# Altium project Systolic.PrjPcb
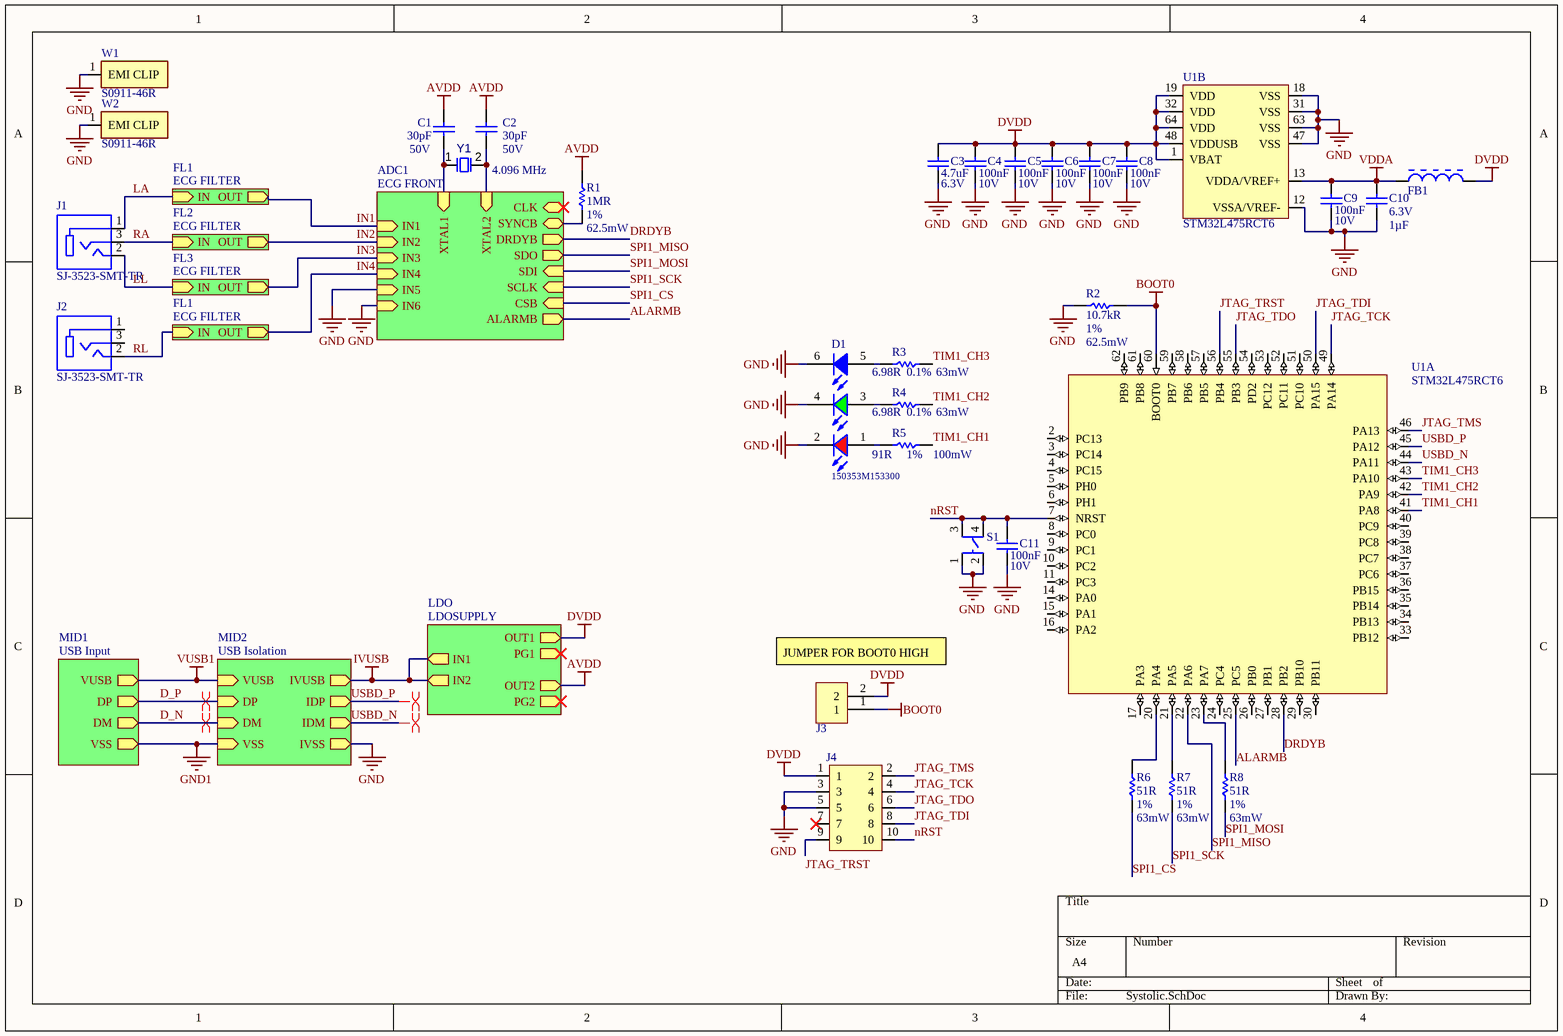
[diagram p0: Systolic.SchDoc]
6 sheets, 95 parts. Net scope: hierarchical (ports join the sheet entries above them; power ports are global).
Board file: Systolic.PcbDoc
Sheets:
  Systolic.SchDoc
    MID1 = USB Input.SchDoc
    MID2 = USB Isolation.SchDoc
    ADC1 = ECG FRONT.SchDoc
    LDO = LDOSUPPLY.SchDoc
    FL1 = ECG FILTER.SchDoc
    FL2 = ECG FILTER.SchDoc
    FL3 = ECG FILTER.SchDoc
    FL1 = ECG FILTER.SchDoc

## Sheet Systolic.SchDoc: Systolic
size A4

### Parts
C1  Capacitance: 30pF  Voltage Rating: 50V  [0402 CAPACITOR]  (hidden comment: MC0402N300J500CT)
C2  Capacitance: 30pF  Voltage Rating: 50V  [0402 CAPACITOR]  (hidden comment: MC0402N300J500CT)
C3  Capacitance: 4.7uF  Voltage Rating: 6.3V  [0402 CAPACITOR]  (hidden comment: CL10A475KQ8NNNC)
C4  Capacitance: 100nF  Voltage Rating: 10V  [0402 CAPACITOR]  (hidden comment: C0402C104K8PACTU)
C5  Capacitance: 100nF  Voltage Rating: 10V  [0402 CAPACITOR]  (hidden comment: C0402C104K8PACTU)
C6  Capacitance: 100nF  Voltage Rating: 10V  [0402 CAPACITOR]  (hidden comment: C0402C104K8PACTU)
C7  Capacitance: 100nF  Voltage Rating: 10V  [0402 CAPACITOR]  (hidden comment: C0402C104K8PACTU)
C8  Capacitance: 100nF  Voltage Rating: 10V  [0402 CAPACITOR]  (hidden comment: C0402C104K8PACTU)
C9  Capacitance: 100nF  Voltage Rating: 10V  [0402 CAPACITOR]  (hidden comment: C0402C104K8PACTU)
C10  value 1µF  Voltage Rating (DC): 6.3V  [0402 CAPACITOR]  (hidden comment: C0402C105K9PACTU)
C11  Capacitance: 100nF  Voltage Rating: 10V  [0402 CAPACITOR]  (hidden comment: C0402C104K8PACTU)
D1  150353M153300  [WL-SFTD_3535]
FB1  BLM15AX601SN1D  [0402 RESISTOR]  (value not drawn)
J1  SJ-3523-SMT-TR  [CUI_SJ-3523-SMT-TR]
J2  SJ-3523-SMT-TR  [CUI_SJ-3523-SMT-TR]
J3  SAMTEC-TSW-102-07-X-SJ  [SAMTEC-TSW-102-07-X-S]  (value not drawn)
J4  FTSH-105-01-L-DV-K-P  [FTSH-105-01-L-DV-K-P]  (value not drawn)
R1  Resistance: 1MR  Tolerance: 1%  Power Rating: 62.5mW  [0402 RESISTOR]  (hidden comment: MCWR04X1004FTL)
R2  Resistance: 10.7kR  Tolerance: 1%  Power Rating: 62.5mW  [0402 RESISTOR]  (hidden comment: MCWR04X1072FTL)
R3  Resistance: 6.98R  Tolerance: 0.1%  Power Rating: 63mW  [0603 RESISTOR]  (hidden comment: RN73C1J6R98BTDF)
R4  Resistance: 6.98R  Tolerance: 0.1%  Power Rating: 63mW  [0603 RESISTOR]  (hidden comment: RN73C1J6R98BTDF)
R5  Resistance: 91R  Tolerance: 1%  Power Rating: 100mW  [0603 RESISTOR]  (hidden comment: CRCW060391R0FKEA)
R6  Resistance: 51R  Tolerance: 1%  Power Rating: 63mW  [0402 RESISTOR]  (hidden comment: CRCW040251R0FKED)
R7  Resistance: 51R  Tolerance: 1%  Power Rating: 63mW  [0402 RESISTOR]  (hidden comment: CRCW040251R0FKED)
R8  Resistance: 51R  Tolerance: 1%  Power Rating: 63mW  [0402 RESISTOR]  (hidden comment: CRCW040251R0FKED)
S1  TL3305BF260QG  [TL3305BF260QG-Footprint-1]  (value not drawn)
U1  STM32L475RCT6  [TSQFP50P1200X1200X160-64N]  (parts A,B of 2)
W1  S0911-46R  [S0911-46R-Footprint-1]
W2  S0911-46R  [S0911-46R-Footprint-1]
Y1  Frequency: 4.096 MHz  [Crystal]  (hidden comment: ABLS-4.096MHZ-20-B-4-Y-T)

### Sub-sheets
ADC1 = ECG FRONT: IN1 (in), IN2 (in), IN3 (in), DRDYB (out), SDO (out), SDI (in), SCLK (in), CSB (in), ALARMB (out), CLK (bidir), XTAL1 (in), XTAL2 (in), SYNCB (bidir), IN6 (in), IN4 (in), IN5 (in)
FL1 = ECG FILTER: OUT (out), IN (in)
FL1 = ECG FILTER: OUT (out), IN (in)
FL2 = ECG FILTER: OUT (out), IN (in)
FL3 = ECG FILTER: OUT (out), IN (in)
LDO = LDOSUPPLY: IN1 (out), PG1 (out), PG2 (out), IN2 (out), OUT1 (out), OUT2 (out)
MID1 = USB Input: VUSB (out), DP (out), DM (out), VSS (out)
MID2 = USB Isolation: VUSB (in), DP (in), DM (in), VSS (in), IVUSB (out), IDP (out), IDM (out), IVSS (out)

### Nets
AVDD: C1.2 C2.2 R1.1 ; sheet LDO/OUT2
BOOT0: J3.1 R2.2 U1.60(BOOT0)
DVDD: C3.2 C4.2 C5.2 C6.2 C7.2 C8.2 FB1.2 J3.2 J4.1 U1.1(VBAT) U1.19(VDD) U1.32(VDD) U1.48(VDDUSB) U1.64(VDD) ; sheet LDO/OUT1
GND: C3.1 C4.1 C5.1 C6.1 C7.1 C8.1 C9.1 C10.1 C11.1 D1.2(K) D1.4(K) D1.6(K) J4.3 J4.5 R2.1 S1.1 S1.2 U1.12(VSSA/VREF-) U1.18(VSS) U1.31(VSS) U1.47(VSS) U1.63(VSS) W1.1(EMI_CLIP) W2.1(EMI_CLIP) ; sheet MID2/IVSS, sheet ADC1/IN6, sheet ADC1/IN5
GND1: sheet MID1/VSS, sheet MID2/VSS
IVUSB: sheet MID2/IVUSB, sheet LDO/IN1, sheet LDO/IN2
VDDA: C9.2 C10.2 FB1.1 U1.13(VDDA/VREF+)
VUSB1: sheet MID1/VUSB, sheet MID2/VUSB
ALARMB: U1.25(PC5) ; sheet ADC1/ALARMB
D_N: sheet MID1/DM, sheet MID2/DM
D_P: sheet MID1/DP, sheet MID2/DP
DRDYB: U1.28(PB2) ; sheet ADC1/DRDYB
IN1: sheet ADC1/IN1, sheet FL1/OUT
IN2: sheet ADC1/IN2, sheet FL2/OUT
IN3: sheet ADC1/IN3, sheet FL3/OUT
IN4: sheet ADC1/IN4, sheet FL1/OUT
JTAG_TCK: J4.4 U1.49(PA14)
JTAG_TDI: J4.8 U1.50(PA15)
JTAG_TDO: J4.6 U1.55(PB3)
JTAG_TMS: J4.2 U1.46(PA13)
JTAG_TRST: J4.9 U1.56(PB4)
LA: J1.1 ; sheet FL1/IN
LL: J1.2 ; sheet FL3/IN
nRST: C11.2 J4.10 S1.3 S1.4 U1.7(NRST)
RA: J1.3 ; sheet FL2/IN
RL: J2.2 ; sheet FL1/IN
SPI1_CS: R6.1 ; sheet ADC1/CSB
SPI1_MISO: U1.22(PA6) ; sheet ADC1/SDO
SPI1_MOSI: R8.1 ; sheet ADC1/SDI
SPI1_SCK: R7.1 ; sheet ADC1/SCLK
TIM1_CH1: R5.2 U1.41(PA8)
TIM1_CH2: R4.2 U1.42(PA9)
TIM1_CH3: R3.2 U1.43(PA10)
USBD_N: U1.44(PA11) ; sheet MID2/IDM
USBD_P: U1.45(PA12) ; sheet MID2/IDP
XTAL_N: C1.1 Y1.1 ; sheet ADC1/XTAL1
XTAL_P: C2.1 Y1.2 ; sheet ADC1/XTAL2
NetD1_1: D1.1(A) R5.1
NetD1_3: D1.3(A) R4.1
NetD1_5: D1.5(A) R3.1
NetR1_2: R1.2 ; sheet ADC1/SYNCB
NetR6_2: R6.2 U1.20(PA4)
NetR7_2: R7.2 U1.21(PA5)
NetR8_2: R8.2 U1.23(PA7)

Not connected (* = marked no-connect by the designer): J2 1 3; J4 7*; U1 2(PC13) 3(PC14) 4(PC15) 5(PH0) 6(PH1) 8(PC0) 9(PC1) 10(PC2) 11(PC3) 14(PA0) 15(PA1) 16(PA2) 17(PA3) 24(PC4) 26(PB0) 27(PB1) 29(PB10) 30(PB11) 33(PB12) 34(PB13) 35(PB14) 36(PB15) 37(PC6) 38(PC7) 39(PC8) 40(PC9) 51(PC10) 52(PC11) 53(PC12) 54(PD2) 57(PB5) 58(PB6) 59(PB7) 61(PB8) 62(PB9)

### Layout directives
differential pair; differential pair class USB: D_N, D_P, USBD_N, USBD_P

### Notes on the sheet
- (near J3) JUMPER FOR BOOT0 HIGH

### Library data of the parts
C1 C2 = CMP-001-00092-2: Cap Ceramic 30pF 50V C0G 5% SMD 0402 125°C; Temperature Coefficient: 30ppm/°C; Packaging: Cut Tape; Case/Package: 0402; Min Operating Temperature: -55°C; Number of Pins: 2; Voltage Rating (DC): 50V; Case Code (Imperial): 0402; Max Operating Temperature: 125°C; REACH SVHC: No SVHC; Case Code (Metric): 1005; Width: 0.5mm; Dielectric: C0G; Tolerance: 5%
C3 = CMP-001-00091-2: Cap Ceramic 4.7uF 6.3V X5R 10% SMD 0402 85°C; Max Operating Temperature: 85°C; Radiation Hardening: No; Voltage: 6.3V; Case Code (Metric): 1608; Case/Package: 0603; Tolerance: 10%; Dielectric: X5R; Mount: Surface Mount; Packaging: Tape and Reel; Height: 0.8mm; Thickness: 0.035inch; Length: 1.6mm; Contact Plating: Tin; Package Quantity: 1; Depth: 0.8mm; Min Operating Temperature: -55°C; Width: 0.031inch; Material: Ceramic; Case Code (Imperial): 0603
C4-C9 C11 = CMP-001-00061-5: Cap Ceramic 0.1uF 10V X5R 10% SMD 0402 85°C; Dissipation Factor: 5%; Number of Pins: 2; Case Code (Metric): 1005; Min Operating Temperature: -55°C; Thickness: 0.022inch; Radiation Hardening: No; Packaging: Tape and Reel; Depth: 0.5mm; Voltage: 10V; Lead Pitch: 0.3mm; Voltage Rating (DC): 10V; Mount: Surface Mount,PCB; Max Operating Temperature: 85°C; Termination: SMD/SMT; Case Code (Imperial): 0402; Width: 0.02inch; REACH SVHC: No SVHC; Contact Plating: Tin,Matte; Length: 1mm; Package Quantity: 1; Dielectric: X5R; Tolerance: 10%; Lead Free: Lead Free; Dielectric Material: Ceramic; Case/Package: 0402; Height: 0.5mm
C10 = CMP-009-0032-3: CAP CER 1UF 6.3V 10% X5R 0402; Manufacturer: KEMET; Dielectric Material: Ceramic; ComponentLink2URL: https://datasheet.ciiva.com/11786/0900766b8116eb59-11786028.pdf?src-supplier=RSComponents; Mount: Surface Mount; REACH SVHC: No SVHC; Height: 0.5mm; Max Operating Temperature: 85°C; ComponentLink5Description: https://datasheet.ciiva.com/18192/getdatasheetpartid-127800-18192427.pdf?src-supplier=Verical; Category: Ceramic Capacitors; Package Quantity: 1; Manufacturer Part Number: C0402C105K9PACTU; ComponentLink5URL: https://datasheet.ciiva.com/18192/getdatasheetpartid-127800-18192427.pdf?src-supplier=Verical; Case/Package: 0402; Tolerance: 10%; Packaging: Tape and Reel; ComponentLink4Description: https://datasheet.ciiva.com/7747/40889-7747623.pdf?src-supplier=Element14; Width: 0.02inch; RoHS: Yes; Depth: 0.5mm; ComponentLink1URL: https://datasheet.ciiva.com/28645/1789732-28645392.pdf?src-supplier=Element14; Length: 1mm; Source: MyLib.SchLib; Stock 1: 76830; Lead Pitch: 0.3mm; Pins: 2; Thickness: 0.022inch; Termination: SMD/SMT; ComponentLink3URL: https://datasheet.ciiva.com/7747/kem-c1006-x5r-smd-7747445.pdf?src-supplier=Element14; Pricing 1: 10=0.02950, 100=0.01910, 500=0.01410, 2500=0.01080, 5000=0.00930 (GBP); ComponentLink1Description: https://datasheet.ciiva.com/28645/1789732-28645392.pdf?src-supplier=Element14; ComponentLink2Description: https://datasheet.ciiva.com/11786/0900766b8116eb59-11786028.pdf?src-supplier=RSComponents; Design Item ID: C0402C105K9PACTU; Radiation Hardening: No; Voltage Rating: 6.3V; ComponentLink4URL: https://datasheet.ciiva.com/7747/40889-7747623.pdf?src-supplier=Element14; Min Operating Temperature: -55°C; Dielectric: X5R; Voltage: 6.3V; ComponentLink3Description: https://datasheet.ciiva.com/7747/kem-c1006-x5r-smd-7747445.pdf?src-supplier=Element14; Lead Free: Lead Free
D1 = CMP-080-0003-1: WL-SFTD SMT Full-color Top LED Diffused, size 3535, Red & Green & Blue, 120deg; Dominant Wavelength typ.: Blue:470nm, Green:520nm, Red:625nm; Peak Wavelength typ.: Blue:465nm, Green:515nm, Red:635nm; Luminous Intensity typ.: Blue:400mcd, Green:1900mcd, Red:800mcd; Chip Technology: AlInGaP + GaN; Forward Voltage typ.: Blue:3.2V, Green:3.2V, Red:2V; Published Date: December 2019; Viewing Angle: 120deg; ComponentLink2Description: Datasheet; ComponentLink2URL: https://www.we-online.com/catalog/datasheet/150353M153300.pdf; ComponentLink1Description: Manufacturer; Part Number: 150353M153300; Publisher: Wurth Elektronik; ComponentLink1URL: http://www.we-online.de; Operating Temperature: -40 to +85degC; Packaging: Tape and Reel; Source: WL-SFTD.SchLib; Mounting Technology: SMT; Emitting Color: Red & Green & Blue; Design Item ID: 150353M153300; Size: 3535
FB1 = CMP-006-00023-1: Ferrite Beads Multi-Layer 600Ohm 25% 100MHz 500mA 340mOhm DCR 0402 T/R; Number of Lines: 1; DC Resistance (DCR): 340mR; Material: Steel,Ferrite; Impedance: 600R; Core Material: Ferrite; Width: 0.5mm; Lead Free: Lead Free; Case/Package: 0402; Max Current Rating: 500mA; Number of Pins: 2; Case Code (Metric): 1005; Case Code (Imperial): 0402; Min Operating Temperature: -55°C; REACH SVHC: No SVHC; Length: 1mm; Termination: SMD/SMT; Package Quantity: 1; Tolerance: 25%; Current Rating: 500mA; Depth: 0.5mm; Height: 0.5mm; Max Operating Temperature: 125°C; Number of Circuits: 1; Test Frequency: 100MHz; Packaging: Tape and Reel; Max DC Current: 500mA
J1 J2 = CMP-023-0000-1: CONN JACK STEREO 3.5MM SMD R/A; Manufacturer 1: CUI; MF: CUI Devices; Number of Conductors: 3; Shielding: Unshielded; Current Rating: 1A; Number of Ports: 1; Gender: Female; ComponentLink2Description: https://datasheet.ciiva.com/7356/sj-352x-smt-series-7356569.pdf?src-supplier=Digi-Key; Availability: Unavailable; Case/Package: LGA-10 STMicroelectronics; ComponentLink2URL: https://datasheet.ciiva.com/7356/sj-352x-smt-series-7356569.pdf?src-supplier=Digi-Key; Price: None; Color: Black; ComponentLink1URL: https://datasheet.ciiva.com/7356/sj-352x-smt-series-7356553.pdf?src-supplier=Digi-Key; Pricing 1: 1000=0.51360, 2000=0.48150, 3000=0.46545, 5000=0.44940, 10000=0.42693, 25000=0.41730 (USD); Stock 1: 40782; Connector Type: Jack; Termination: Solder; Design Item ID: SJ-3523-SMT-TR; Lead Free: Lead Free; Contact Plating: Silver; Value: *; MP: SJ-3523-SMT-TR; ComponentLink1Description: https://datasheet.ciiva.com/7356/sj-352x-smt-series-7356553.pdf?src-supplier=Digi-Key; SnapEDA_Link: https://www.snapeda.com/parts/SJ-3523-SMT-TR/CUI%20Devices/view-part/251570/?ref=snap; Category: Connectors; Mount: Surface Mount; Packaging: Cut Tape; CUI_purchase_URL: https://www.cuidevices.com/product/interconnect/connectors/audio-connectors/jacks/sj-352x-smt-series?utm_source=snapeda.com&utm_medium=referral&utm_campaign=snapedaBOM; RoHS: Yes; Manufacturer Part Number 1: SJ-3523-SMT-TR; Source: SnapEDAsch.SchLib; Orientation: Horizontal
J3 = CMP-087-0000-1: Component Type: Standard; Design Item ID: SAMTEC-TSW-102-07-X-SJ; Source: SAMTEC-TSW-102-07-X-S.SCHLIB; Pin Count: 2
J4 = CMP-066-0000-6: TERMINAL STRIP, .050"(1.27mm) PITCH, 10 PINS, KEYED; MANUFACTURER: SAMTEC; PCB DECAL: FTSH-105-01-XXX-DV-K; Design Item ID: FTSH-105-01-L-DV-K-P; Source: FTSH-105-01-L-DV-K-P.SCHLIB; CREATED: November 30, 2016 - Wendy Xin
R1 = CMP-009-00177-1: 1MR 0402; Voltage Rating (DC): 50V; Temperature Coefficient: 100ppm/°C; Case Code (Metric): 1005; Case/Package: 0402; Voltage Rating: 50V; Mount: Surface Mount; Packaging: Cut Tape; REACH SVHC: No SVHC; Composition: Thick Film; Case Code (Imperial): 0402
R2 = CMP-009-00185-1: MULTICOMP - MCMR04X24R0FTL - RES, CERAMIC 10.7kR, 1%, 0.063W, 0402; Voltage Rating (DC): 50V; Temperature Coefficient: 100ppm/°C; Case Code (Metric): 1005; Composition: Ceramic; REACH SVHC: No SVHC; Case Code (Imperial): 0402; Packaging: Cut Tape; Voltage Rating: 50V; Case/Package: 0402
R3 R4 = CMP-009-00193-1: RES, THIN FILM 6.98R, 0.1%, 0.063W, 0603; Voltage Rating (DC): 50V; Temperature Coefficient: 10ppm/°C; Number of Resistors: 1; Max Operating Temperature: 155°C; Case Code (Metric): 1608; Length: 1.55mm; Weight: 7.1E-05oz; Composition: Thin Film; Height: 0.45mm; Case Code (Imperial): 0603; Case/Package: 0603; Mount: Surface Mount; Min Operating Temperature: -55°C; Voltage Rating: 50V; Termination: Solder; Width: 0.8mm; Package Quantity: 1000; Packaging: Tape and Reel; ELV: Compliant; Number of Terminations: 2
R5 = CMP-009-00192-1: RES, THICK FILM 91R, 1%, 0.1W, 0603; Voltage Rating: 75V; Temperature Coefficient: 100ppm/°C; Height: 0.45mm; Packaging: Tape and Reel; Package Quantity: 10; Military Standard: Not; Composition: Thick Film; Contact Plating: Tin; Case Code (Imperial): 0603; Radiation Hardening: No; Weight: 7.1E-05oz; Case Code (Metric): 1608; Case/Package: 0603; REACH SVHC: Unknown; Termination: SMD/SMT; Lead Free: Lead Free; Depth: 0.85mm; Length: 1.55mm; Max Operating Temperature: 155°C; Min Operating Temperature: -55°C; Voltage Rating (DC): 75V; Number of Pins: 2; Number of Terminations: 2; Features: Automotive AEC-Q200; Width: 0.033inch; Max Power Dissipation: 100mW
R6-R8 = CMP-009-00186-1: 51R 0402 AEC-Q200; Voltage Rating (DC): 50V; Temperature Coefficient: 100ppm/°C; Lead Free: Lead Free; REACH SVHC: Unknown; Package Quantity: 10; Case Code (Imperial): 0402; Case Code (Metric): 1005; Military Standard: Not; Length: 1mm; Width: 0.5mm; Number of Terminations: 2; Voltage Rating: 50V; Weight: 2.3E-05oz; Case/Package: 0402; Max Operating Temperature: 155°C; Max Power Dissipation: 63mW; Termination: SMD/SMT; Depth: 0.5mm; Packaging: Tape and Reel; Features: Automotive AEC-Q200; Min Operating Temperature: -55°C; Composition: Thick Film; Radiation Hardening: No; Number of Pins: 2; Height: 0.35mm; Contact Plating: Tin
S1 = CMP-011-00013-1: Switch Tactile N.O. SPST Round Button Gull Wing 0.05A 12VDC 2.55N SMD T/R; Illumination Type: Non-Illuminated; Mechanical Life: 200000Cycles; Actuator Type: Standard; Operating Force: 260gf; Switch Travel: 0.2mm; Switch Function: Off-Mom; Lead Free: Lead Free; Throw Configuration: SPST; Termination: Gull Wing; Max Operating Temperature: 70°C; Mount: Surface Mount; Min Operating Temperature: -20°C; Packaging: Tape and Reel
U1 = CMP-020-00023-2: Ultra-low-power with FPU ARM Cortex-M4 MCU 80 MHz with 256 Kbytes Flash, USB OTG; Oscillator Type: Internal; Frequency: 80MHz; Peripherals: Brown-out Detect/Reset,PWM,WDT,DMA; Interface: I2C,SPI,USB,IrDA,MMC,SD,UART,USART; Memory Size: 256KB; Number of I/Os: 51; Core Architecture: ARM; Max Operating Temperature: 85°C; Min Operating Temperature: -40°C; Memory Type: FLASH; Case/Package: LQFP; Packaging: Tray
W1 W2 = CMP-00028-00008-1: Compact RFI Shield Clip Socket Surface Mount Beryllium Copper T/R
Y1 = CMP-003-00032-1: Load Capacitance: 20 pF; Frequency Tolerance: 30ppm

## Sheet USB Input.SchDoc
size A
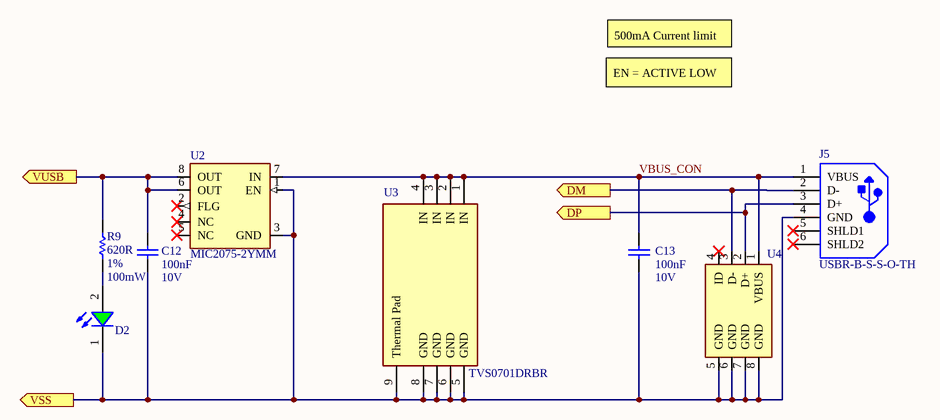
[diagram p1: USB Input.SchDoc]

### Parts
C12  Capacitance: 100nF  Voltage Rating: 10V  [0402 CAPACITOR]  (hidden comment: C0402C104K8PACTU)
C13  Capacitance: 100nF  Voltage Rating: 10V  [0402 CAPACITOR]  (hidden comment: C0402C104K8PACTU)
D2  150060VS73220  [WL-SMCC_0603_RS_VS_YS]  (value not drawn)
J5  USBR-B-S-S-O-TH  [SMTC-USBR-TH-4_V]
R9  Resistance: 620R  Tolerance: 1%  Power Rating: 100mW  [0603 RESISTOR]  (hidden comment: MCMR06X6200FTL)
U2  MIC2075-2YMM  [TSOP65P490X102-8N]
U3  TVS0701DRBR  [FP-DRB0008A-MFG]
U4  Rclamp1255P.TGT  [SON40P200X65-8N]  (value not drawn)

### Ports
DM (out), DP (out), VSS (out), VUSB (out)

### Nets
GND1: C12.1 C13.1 D2.1(K) J5.4(GND) U2.1(EN) U2.3(GND) U3.5(GND) U3.6(GND) U3.7(GND) U3.8(GND) U3.9(Thermal_Pad) U4.5(GND) U4.6(GND) U4.7(GND) U4.8(GND) ; port VSS
VUSB1: C12.2 R9.2 U2.6(OUT) U2.8(OUT) ; port VUSB
D_N: J5.2(D-) U4.3(D-) ; port DM
D_P: J5.3(D+) U4.2(D+) ; port DP
VBUS_CON: C13.2 J5.1(VBUS) U2.7(IN) U3.1(IN) U3.2(IN) U3.3(IN) U3.4(IN) U4.1(VBUS)
NetD2_2: D2.2(A) R9.1

Not connected (* = marked no-connect by the designer): J5 5(SHLD1)* 6(SHLD2)*; U2 2(FLG)* 4(NC)* 5(NC)*; U4 4(ID)*

### Notes on the sheet
- 500mA Current limit
- EN = ACTIVE LOW

### Library data of the parts
C12 C13 = CMP-001-00061-5: as C4 on sheet Systolic; Number of Pins: 2; Case Code (Metric): 1005; Min Operating Temperature: -55°C; Thickness: 0.022inch; Radiation Hardening: No; Packaging: Tape and Reel; Depth: 0.5mm; Voltage: 10V; Lead Pitch: 0.3mm; Voltage Rating (DC): 10V; Mount: Surface Mount,PCB; Max Operating Temperature: 85°C; Termination: SMD/SMT; Case Code (Imperial): 0402; Width: 0.02inch; REACH SVHC: No SVHC; Contact Plating: Tin,Matte; Length: 1mm; Package Quantity: 1; Dielectric: X5R; Tolerance: 10%; Lead Free: Lead Free; Dielectric Material: Ceramic; Case/Package: 0402; Height: 0.5mm
D2 = 150060VS73220: WL-SMCC SMD Mono-color Chip LED Compact, size 0603, Bright Green, 2V, 120deg; Dominant Wavelength: 573nm; Luminous Intensity: 60mcd; Peak Wavelength: 575nm; Chip Technology: AlInGaP; ComponentLink1URL: http://www.we-online.de; ComponentLink2Description: Datasheet; ComponentLink2URL: https://katalog.we-online.com/led/datasheet/150060VS73220.pdf; Part Number: 150060VS73220; Published Date: July 2019; Publisher: Wurth Elektronik; Size: 0603; Viewing Angle: 120deg; Packaging: Tape and Reel; Emitting Color: Bright Green; Mounting Technology: SMT; Forward Voltage: 2V; Operating Temperature: -40 to +85degC
J5 = CMP-020-0000-1: Conn USB F 4 POS 2.5mm Solder RA Thru-Hole 4 Terminal 1 Port Tray; Manufacturer: SamtecInc.; Manufacturer 1: Samtec; Body Orientation: RightAngle; Rad Hard: No; Max Voltage Rating (AC): 30V; USB Standard: USB 2.0; Number of Contacts: 4; Number of Ports: 1; ComponentLink1Description: https://datasheet.ciiva.com/6743/1759611-6743744.pdf?src-supplier=Newark; Mounting Technology: ThroughHole; Datasheet URL: http://suddendocs.samtec.com/prints/usbr-b-s-x-o-th-x-mkt.pdf; Orientation: Right Angle; Length: 14.9mm; Max Operating Temperature: 85°C; Manufacturer Part Number 1: USBR-B-S-S-O-TH; ComponentLink5URL: https://datasheet.ciiva.com/3094/usb-b-3094454.pdf?src-supplier=Avnet; Package Quantity: 1; Case/Package: 4-Pin Through Hole Device, Body 16.3 x 12.04 mm, Pitch 2.5 mm; ComponentLink3URL: https://datasheet.ciiva.com/851/usbr-b-s-x-o-th-x-mkt-851782.pdf?src-supplier=Digi-Key; Manufacturer URL: http://www.samtec.com/; Min Operating Temperature: -50°C; REACH SVHC: No SVHC; Connector Type: USB; ComponentLink4Description: https://datasheet.ciiva.com/26826/getdatasheetpartid-475715-26826565.pdf?src-supplier=Verical; Depth: 16.5mm; Contact Plating: Gold; ComponentLink2URL: https://datasheet.ciiva.com/7622/452555-7622677.pdf?src-supplier=Element14; ComponentLink5Description: https://datasheet.ciiva.com/3094/usb-b-3094454.pdf?src-supplier=Avnet; Packaging: Trays; Package Reference: USBR-TH; Gender: F; Design Item ID: CMP-2000-07371-1; Number of Terminals: 4; Category: ConnectorAudioandVideo; ComponentLink1URL: https://datasheet.ciiva.com/6743/1759611-6743744.pdf?src-supplier=Newark; Pricing 1: 1=1.75000, 10=1.58800, 25=1.49040, 50=1.42560, 100=1.36080, 250=1.23120, 500=1.13400, 1000=0.97200, 2500=0.90720 (USD); Termination Method: Solder; Housing Material: Thermoplastic; Mounting: ThroughHole; Datasheet Version: Rev. J, 10/2010; ComponentLink3Description: https://datasheet.ciiva.com/851/usbr-b-s-x-o-th-x-mkt-851782.pdf?src-supplier=Digi-Key; Radiation Hardening: No; ComponentLink4URL: https://datasheet.ciiva.com/26826/getdatasheetpartid-475715-26826565.pdf?src-supplier=Verical; Pitch: 2.5mm; Source: Components - 12.06.20 - 19.51.SchLib; Mount: Through Hole,Horizontal; RoHS: Yes; Termination: Solder; Contact Material: Bronze; ComponentLink2Description: https://datasheet.ciiva.com/7622/452555-7622677.pdf?src-supplier=Element14; Type: USB; Stock 1: 4434
R9 = CMP-009-00202-2: RES, CERAMIC, 620R, 1%, 0.1W, 0603; Temperature Coefficient: 100ppm/°C; Voltage Rating: 75V; Case/Package: 0603; Case Code (Metric): 1608; Packaging: Cut Tape; REACH SVHC: No SVHC; Case Code (Imperial): 0603; Composition: Ceramic; Voltage Rating (DC): 75V
U2 = CMP-00028-00007-2: MIC2075 Series 5.5 V 140 mOhm Single-Channel Power Distribution Switch - SOIC-8; Max Output Current: 500mA; Output Configuration: High Side; Interface: On/Off; Number of Outputs: 1; Fault Protection: Over Temperature; Min Operating Temperature: -40°C; Max Operating Temperature: 85°C; Packaging: Rail/Tube; Lead Free: Lead Free
U3 = CMP-04985-000001-1: TVS ARRAYS; Manufacturer: Texas instruments; Capacitance: 77pF; Peak Pulse Current: 30A; Standoff Height: 0mm; Direction: Bidirectional; Number Of Channels: 1; Breakdown Voltage: 9.3V; Reverse Standoff Voltage: 7V; Value: 77pF; Clamping Voltage: 11V; Temperature Range Low: -40°C; Category: IC; Lead Free: Yes; Device Class L2: ESD and Circuit Protection ICs; Ambient Temperature Range High: +125°C; RoHS: TRUE; Manufacturer Part Number: TVS0701DRBR; Device Class L3: unset; Ambient Temperature Range Low: -40°C; Mouser Description: 7-V bidirectional flat-clamp surge protection device 8-SON -40 to 125; Height: 1mm; Octopart: https://octopart.com/tvs0701drbr-texas+instruments-96189204; Automotive: No; Temperature: -40°C to +125°C; ComponentLink2URL: http://www.ti.com/lit/ds/symlink/tvs0701.pdf; Device Class L1: Circuit Protection; Package: DRB0008A; Digikey Description: TVS ARRAYS; Temperature Range High: +125°C; ComponentLink2Description: Datasheet
U4 = CMP-00030-00003-1: Tvs Diode 4V 12.5V SLP2018P6; Peak Pulse Power: 40W; Power Line Protection: Yes; Min Breakdown Voltage: 4.5V; Peak Pulse Current: 3A; Number of Bidirectional Channels: 3; Reverse Standoff Voltage: 4V; Min Operating Temperature: -55°C; Clamping Voltage: 12.5V; Packaging: Tape and Reel; Mount: Surface Mount; Lead Free: Lead Free; Max Operating Temperature: 125°C

## Sheet USB Isolation.SchDoc
size A
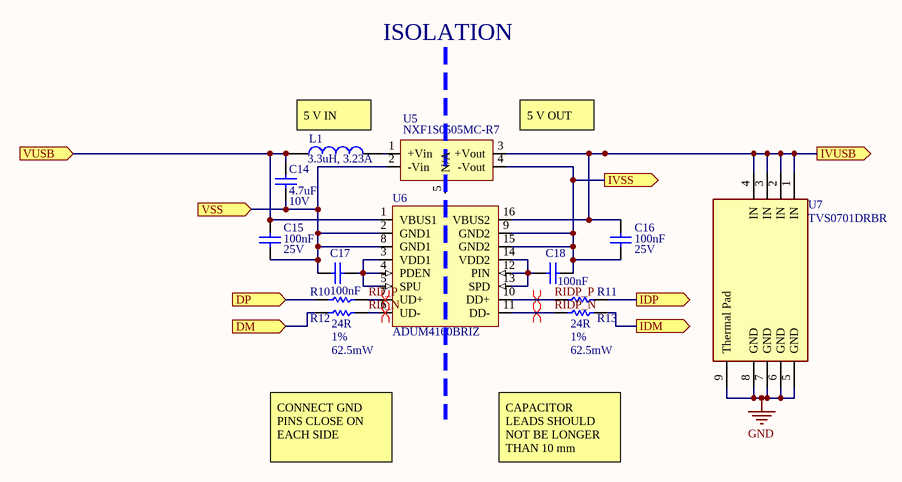
[diagram p2: USB Isolation.SchDoc]

### Parts
C14  value 4.7uF  Voltage Rating: 10V  [0603 CAPACITOR]  (hidden comment: LMK107BJ475KA-T)
C15  value 100nF  Voltage Rating: 25V  [0603 CAPACITOR]  (hidden comment: CGA3E2X7R1E104K080AA)
C16  value 100nF  Voltage Rating: 25V  [0603 CAPACITOR]  (hidden comment: CGA3E2X7R1E104K080AA)
C17  value 100nF  [0603 CAPACITOR]  (hidden comment: CGA3E2X7R1E104K080AA)
C18  value 100nF  [0603 CAPACITOR]  (hidden comment: CGA3E2X7R1E104K080AA)
L1  3.3uH, 3.23A  [WE-LQS_4025]
R10  MCMR04X24R0FTL  [0402 RESISTOR]  (value not drawn)
R11  MCMR04X24R0FTL  [0402 RESISTOR]  (value not drawn)
R12  Resistance: 24R  Tolerance: 1%  Power Rating: 62.5mW  [0402 RESISTOR]  (hidden comment: MCMR04X24R0FTL)
R13  Resistance: 24R  Tolerance: 1%  Power Rating: 62.5mW  [0402 RESISTOR]  (hidden comment: MCMR04X24R0FTL)
U5  NXF1S0505MC-R7  [QFN254P1524X1067X501-6N]
U6  ADUM4160BRIZ  [SOIC127P1030X265-16N]
U7  TVS0701DRBR  [FP-DRB0008A-MFG]

### Ports
DM (in), DP (in), IDM (out), IDP (out), IVSS (out), IVUSB (out), VSS (in), VUSB (in)

### Nets
GND: C16.1 C18.1 U5.4(-Vout) U6.9(GND2) U6.15(GND2) U7.5(GND) U7.6(GND) U7.7(GND) U7.8(GND) U7.9(Thermal_Pad) ; port IVSS
GND1: C14.1 C15.1 C17.2 U5.2(-Vin) U6.2(GND1) U6.8(GND1) ; port VSS
IVUSB: C16.2 U5.3(+Vout) U6.16(VBUS2) U7.1(IN) U7.2(IN) U7.3(IN) U7.4(IN) ; port IVUSB
VUSB1: C14.2 C15.2 L1.1 U6.1(VBUS1) ; port VUSB
D_N: R12.1 ; port DM
D_P: R10.1 ; port DP
RD_N: R12.2 U6.6(UD-)
RD_P: R10.2 U6.7(UD+)
RIDP_N: R13.1 U6.11(DD-)
RIDP_P: R11.1 U6.10(DD+)
USBD_N: R13.2 ; port IDM
USBD_P: R11.2 ; port IDP
NetC17_1: C17.1 U6.3(VDD1) U6.4(PDEN) U6.5(SPU)
NetC18_2: C18.2 U6.12(PIN) U6.13(SPD) U6.14(VDD2)
NetL1_2: L1.2 U5.1(+Vin)

Not connected (* = marked no-connect by the designer): U5 5(N/A)

### Layout directives
differential pair; differential pair class USB: RD_N, RD_P, RIDP_N, RIDP_P

### Notes on the sheet
- ISOLATION
- 5 V IN
- (near U5) 5 V OUT
- CONNECT GND PINS CLOSE ON EACH SIDE
- CAPACITOR LEADS SHOULD NOT BE LONGER THAN 10 mm

### Library data of the parts
C14 = CMP-001-00085-5: Cap Ceramic 4.7uF 10V X5R 10% SMD 0603 85°C; Case Code (Imperial): 0603; Number of Pins: 2; Dielectric: X5R; Dielectric Material: Ceramic; Contact Plating: Nickel; REACH SVHC: Unknown; Package Quantity: 1; Width: 0.031inch; Lead Free: Lead Free; Min Operating Temperature: -55°C; Packaging: Tape and Reel; Height: 0.8mm; Case Code (Metric): 1608; Length: 1.6mm; Tolerance: 10%; Case/Package: 0603; Max Operating Temperature: 85°C; Radiation Hardening: No; Mount: Surface Mount; Voltage Rating (DC): 10V; Depth: 0.8mm; Halogen Free: Halogen Free; Termination: SMD/SMT; Thickness: 0.035inch
C15-C18 = CMP-001-00083-5: Cap Ceramic 0.1uF 25V X7R 10% SMD 0603 125°C; Max Operating Temperature: 125°C; Mount: Surface Mount; Thickness: 0.035inch; Composition: Ceramic; Lead Free: Lead Free; Case/Package: 0603; Packaging: Tape and Reel; Ratings: AEC-Q200; Min Operating Temperature: -55°C; Weight: 7.1E-05oz; Width: 0.031inch; Termination: SMD/SMT; Tolerance: 10%; Package Quantity: 1; REACH SVHC: No SVHC; Dielectric: X7R; Voltage Rating (DC): 25V; Case Code (Imperial): 0603; Height: 0.8mm; Case Code (Metric): 1608; Depth: 0.8mm; Length: 1.6mm
  C17 C18: Voltage Rating: 25V
L1 = 74404043033A: WE-LQS SMT Power Inductor, size 4025, 3.3uH, 3.23A; Manufacturer: Wurth Elektronik; Saturation Current: 1.75A; Self Resonant Frequency: 75MHz; DC Resistance: 33mOhm; ComponentLink1Description: Manufacturer; ComponentLink1URL: http://www.we-online.de; ComponentLink2Description: Datasheet; ComponentLink2URL: https://www.we-online.com/catalog/datasheet/74404043033A.pdf; Published Date: May 2020; Rated Current: 3.23A; Operating Temperature: -40 to +125degC; Mounting Technology: SMT; Packaging: Tape and Reel; Manufacturer Part Number: 74404043033A; Inductance: 3.3uH; Size: 4025
R10 R11 = CMP-009-00178-9: MULTICOMP - MCMR04X24R0FTL - RES, CERAMIC 24R, 1%, 0.063W, 0402; Power Rating: 62.5mW; Voltage Rating (DC): 50V; Temperature Coefficient: 100ppm/°C; Resistance: 24R; Tolerance: 1%; REACH SVHC: No SVHC; Case/Package: 0402; Packaging: Cut Tape; Voltage Rating: 50V; Case Code (Metric): 1005; Composition: Ceramic; Case Code (Imperial): 0402
R12 R13 = CMP-009-00178-9: MULTICOMP - MCMR04X24R0FTL - RES, CERAMIC 24R, 1%, 0.063W, 0402; Voltage Rating (DC): 50V; Temperature Coefficient: 100ppm/°C; REACH SVHC: No SVHC; Case/Package: 0402; Packaging: Cut Tape; Voltage Rating: 50V; Case Code (Metric): 1005; Composition: Ceramic; Case Code (Imperial): 0402
U5 = CMP-019-00050-4: Module Dc-dc 5 Vin 1-OUT 5V 0.2A 1W 5-PIN SMD T/r
U6 = CMP-019-00049-3: ANALOG DEVICES   ADUM4160BRIZ   Digital Isolator, 1, 60 ns, 3.1 V, 5.5 V, SOIC, 16 Pins; Isolated Power: No; Number of Channels: 2; Min Supply Voltage: 3.1V; Propagation Delay: 70ns; Max Supply Voltage: 5.5V; Rise Time: 20ns; Channel Type: Bidirectional; Nominal Supply Current: 6mA; Data Rate: 12Mbps; Max Input Current: 8mA; Turn-On Delay Time: 60ns; Depth: 2.65mm; Contact Plating: Tin,Matte; REACH SVHC: No SVHC; Min Operating Temperature: -40°C; Lead Free: Contains Lead; Number of Pins: 16; Packaging: Rail/Tube; Case/Package: SOIC; Length: 10.5mm; Package Quantity: 37; Max Operating Temperature: 105°C; Width: 7.6mm
U7 = CMP-04985-000001-1: as U3 on sheet USB Input; Temperature Range Low: -40°C; Category: IC; Lead Free: Yes; Device Class L2: ESD and Circuit Protection ICs; Ambient Temperature Range High: +125°C; RoHS: TRUE; Manufacturer Part Number: TVS0701DRBR; Device Class L3: unset; Ambient Temperature Range Low: -40°C; Mouser Description: 7-V bidirectional flat-clamp surge protection device 8-SON -40 to 125; Height: 1mm; Octopart: https://octopart.com/tvs0701drbr-texas+instruments-96189204; Automotive: No; Temperature: -40°C to +125°C; ComponentLink2URL: http://www.ti.com/lit/ds/symlink/tvs0701.pdf; Device Class L1: Circuit Protection; Package: DRB0008A; Digikey Description: TVS ARRAYS; Temperature Range High: +125°C; ComponentLink2Description: Datasheet

## Sheet ECG FRONT.SchDoc
size A
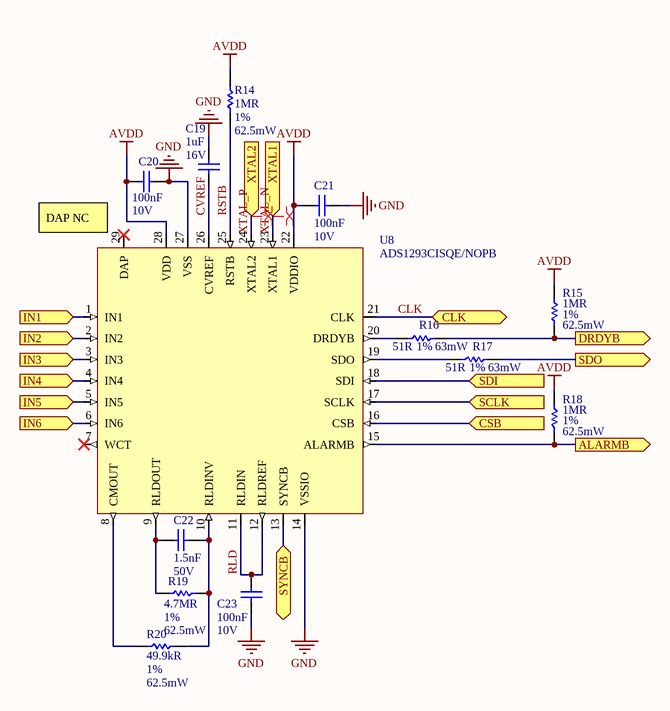
[diagram p3: ECG FRONT.SchDoc]

### Parts
C19  Voltage Rating: 16V  Capacitance: 1uF  [0402 CAPACITOR]  (hidden comment: EMK105BJ105KV-F)
C20  Capacitance: 100nF  Voltage Rating: 10V  [0402 CAPACITOR]  (hidden comment: C0402C104K8PACTU)
C21  Capacitance: 100nF  Voltage Rating: 10V  [0402 CAPACITOR]  (hidden comment: C0402C104K8PACTU)
C22  Capacitance: 1.5nF  Voltage Rating: 50V  [0402 CAPACITOR]  (hidden comment: 0402B152J500CT)
C23  Capacitance: 100nF  Voltage Rating: 10V  [0402 CAPACITOR]  (hidden comment: C0402C104K8PACTU)
R14  Resistance: 1MR  Tolerance: 1%  Power Rating: 62.5mW  [0402 RESISTOR]  (hidden comment: MCWR04X1004FTL)
R15  Resistance: 1MR  Tolerance: 1%  Power Rating: 62.5mW  [0402 RESISTOR]  (hidden comment: MCWR04X1004FTL)
R16  Resistance: 51R  Tolerance: 1%  Power Rating: 63mW  [0402 RESISTOR]  (hidden comment: CRCW040251R0FKED)
R17  Resistance: 51R  Tolerance: 1%  Power Rating: 63mW  [0402 RESISTOR]  (hidden comment: CRCW040251R0FKED)
R18  Resistance: 1MR  Tolerance: 1%  Power Rating: 62.5mW  [0402 RESISTOR]  (hidden comment: MCWR04X1004FTL)
R19  Resistance: 4.7MR  Tolerance: 1%  Power Rating: 62.5mW  [0402 RESISTOR]  (hidden comment: MCWR04W4704FTL)
R20  Resistance: 49.9kR  Tolerance: 1%  Power Rating: 62.5mW  [0402 RESISTOR]  (hidden comment: MCWR04X4992FTL)
U8  ADS1293CISQE/NOPB  [QFN50P500X500X80_HS-29N]

### Ports
ALARMB (out), CLK (bidir), CSB (in), DRDYB (out), IN1 (in), IN2 (in), IN3 (in), IN4 (in), IN5 (in), IN6 (in), SCLK (in), SDI (in), SDO (out), SYNCB (bidir), XTAL1 (in), XTAL2 (in)

### Nets
AVDD: C20.1 C21.1 R14.2 R15.2 R18.2 U8.22(VDDIO) U8.28(VDD)
GND: C19.2 C20.2 C21.2 C23.2 U8.5(IN5) U8.6(IN6) U8.14(VSSIO) U8.27(VSS) ; port IN5, port IN6
ALARMB: R18.1 U8.15(ALARMB) ; port ALARMB
CLK: U8.21(CLK) ; port CLK
CVREF: C19.1 U8.26(CVREF)
DRDYB: R15.1 R16.2 ; port DRDYB
IN1: U8.1(IN1) ; port IN1
IN2: U8.2(IN2) ; port IN2
IN3: U8.3(IN3) ; port IN3
IN4: U8.4(IN4) ; port IN4
RLD: C23.1 U8.11(RLDIN) U8.12(RLDREF)
RSTB: R14.1 U8.25(RSTB)
SPI1_CS: U8.16(CSB) ; port CSB
SPI1_MISO: R17.2 ; port SDO
SPI1_MOSI: U8.18(SDI) ; port SDI
SPI1_SCK: U8.17(SCLK) ; port SCLK
XTAL_N: U8.23(XTAL1) ; port XTAL1
XTAL_P: U8.24(XTAL2) ; port XTAL2
NetC22_1: C22.1 R19.1 R20.1 U8.10(RLDINV)
NetC22_2: C22.2 R19.2 U8.9(RLDOUT)
NetR1_2: U8.13(SYNCB) ; port SYNCB
NetR16_1: R16.1 U8.20(DRDYB)
NetR17_1: R17.1 U8.19(SDO)
NetR20_2: R20.2 U8.8(CMOUT)

Not connected (* = marked no-connect by the designer): U8 7(WCT)* 29(DAP)*

### Layout directives
differential pair; differential pair class XTAL: XTAL_N, XTAL_P

### Notes on the sheet
- (near U8) DAP NC

### Library data of the parts
C19 = CMP-001-00084-6: Cap Ceramic 1uF 16V X5R 10% SMD 0402 85°C; Case Code (Metric): 1005; Thickness: 0.022inch; REACH SVHC: Unknown; Termination: SMD/SMT; Packaging: Tape and Reel; Max Operating Temperature: 85°C; Package Quantity: 1; Tolerance: 10%; Mount: Surface Mount; Number of Pins: 2; Halogen Free: Halogen Free; Height: 0.5mm; Voltage Rating (DC): 16V; Case Code (Imperial): 0402; Case/Package: 0402; Width: 0.02inch; Depth: 0.5mm; Radiation Hardening: No; Min Operating Temperature: -55°C; Length: 1mm; Dielectric: X5R
C20 C21 C23 = CMP-001-00061-5: as C4 on sheet Systolic; Number of Pins: 2; Case Code (Metric): 1005; Min Operating Temperature: -55°C; Thickness: 0.022inch; Radiation Hardening: No; Packaging: Tape and Reel; Depth: 0.5mm; Voltage: 10V; Lead Pitch: 0.3mm; Voltage Rating (DC): 10V; Mount: Surface Mount,PCB; Max Operating Temperature: 85°C; Termination: SMD/SMT; Case Code (Imperial): 0402; Width: 0.02inch; REACH SVHC: No SVHC; Contact Plating: Tin,Matte; Length: 1mm; Package Quantity: 1; Dielectric: X5R; Tolerance: 10%; Lead Free: Lead Free; Dielectric Material: Ceramic; Case/Package: 0402; Height: 0.5mm
C22 = CMP-001-00089-2: Cap Ceramic 1.5nF 50V X7R 5% SMD 0402 125°C; Packaging: Tape and Reel; Max Operating Temperature: 125°C; Case Code (Metric): 1005; Length: 1mm; Voltage Rating (DC): 50V; Tolerance: 5%; Min Operating Temperature: -55°C; REACH SVHC: Unknown; Case Code (Imperial): 0402; Dielectric: X7R; Depth: 0.5mm; Case/Package: 0402
R14 R15 R18 = CMP-009-00177-1: as R1 on sheet Systolic; Case Code (Metric): 1005; Case/Package: 0402; Voltage Rating: 50V; Mount: Surface Mount; Packaging: Cut Tape; REACH SVHC: No SVHC; Composition: Thick Film; Case Code (Imperial): 0402
R16 R17 = CMP-009-00186-1: as R6 on sheet Systolic; Lead Free: Lead Free; REACH SVHC: Unknown; Package Quantity: 10; Case Code (Imperial): 0402; Case Code (Metric): 1005; Military Standard: Not; Length: 1mm; Width: 0.5mm; Number of Terminations: 2; Voltage Rating: 50V; Weight: 2.3E-05oz; Case/Package: 0402; Max Operating Temperature: 155°C; Max Power Dissipation: 63mW; Termination: SMD/SMT; Depth: 0.5mm; Packaging: Tape and Reel; Features: Automotive AEC-Q200; Min Operating Temperature: -55°C; Composition: Thick Film; Radiation Hardening: No; Number of Pins: 2; Height: 0.35mm; Contact Plating: Tin
R19 = CMP-009-00181-1: Res Thick FIlm 4.7MR 50V 1% SMD 0402; Temperature Coefficient: 100ppm/°C; REACH SVHC: No SVHC; Voltage Rating: 50V; Voltage Rating (DC): 50V; Case/Package: 0402; Case Code (Metric): 1005; Packaging: Cut Tape; Mount: Surface Mount; Case Code (Imperial): 0402; Composition: Thick Film
R20 = CMP-009-00182-1: Res Thick FIlm 49.9kR 50V 1% SMD 0402; Temperature Coefficient: 100ppm/°C; Packaging: Cut Tape; Composition: Thick Film; Voltage Rating: 50V; Case/Package: 0402; REACH SVHC: No SVHC; Voltage Rating (DC): 50V; Case Code (Imperial): 0402; Case Code (Metric): 1005
U8 = CMP-014-00002-4: AFE General Purpose 3ADC 24-Bit 3.3V/5V 28-Pin LLP EP T/R; Operating Supply Current: 825uA; Number of Channels: 3; Resolution: 24b; Max Supply Voltage: 5.5V; Interface: SPI; Signal to Noise Ratio (SNR): 110dB; Min Supply Voltage: 2.7V; Conversion Rate: 25.6KS/s; Number of Bits: 24; Sampling Rate: 25KS/s; REACH SVHC: No SVHC; Length: 5mm; Max Operating Temperature: 85°C; Radiation Hardening: No; Type: General Purpose; Number of Pins: 28; Height: 0.8mm; Mount: Surface Mount; Min Operating Temperature: -20°C; Lead Free: Lead Free; Width: 5mm; Number of A/D Converters: 3; Packaging: Tape and Reel; Number of Converters: 3; Number of Inputs: 3

## Sheet LDOSUPPLY.SchDoc
size A
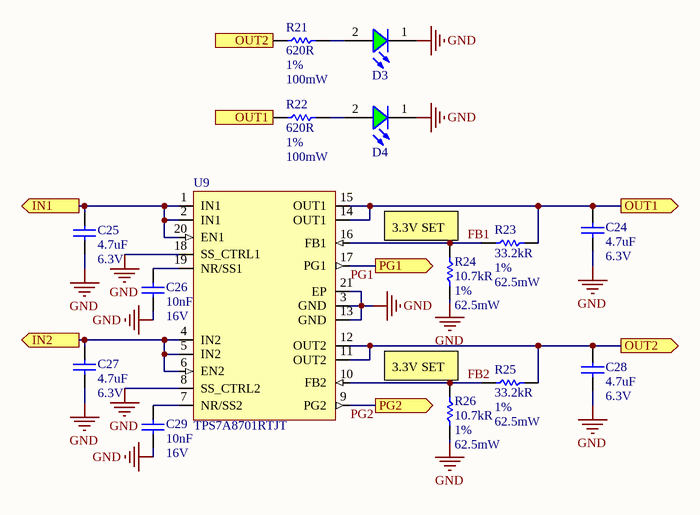
[diagram p4: LDOSUPPLY.SchDoc]

### Parts
C24  Capacitance: 4.7uF  Voltage Rating: 6.3V  [0402 CAPACITOR]  (hidden comment: CL10A475KQ8NNNC)
C25  Capacitance: 4.7uF  Voltage Rating: 6.3V  [0402 CAPACITOR]  (hidden comment: CL10A475KQ8NNNC)
C26  Capacitance: 10nF  Voltage Rating: 16V  [0402 CAPACITOR]  (hidden comment: MC0402B103J160CT)
C27  Capacitance: 4.7uF  Voltage Rating: 6.3V  [0402 CAPACITOR]  (hidden comment: CL10A475KQ8NNNC)
C28  Capacitance: 4.7uF  Voltage Rating: 6.3V  [0402 CAPACITOR]  (hidden comment: CL10A475KQ8NNNC)
C29  Capacitance: 10nF  Voltage Rating: 16V  [0402 CAPACITOR]  (hidden comment: MC0402B103J160CT)
D3  150060VS73220  [WL-SMCC_0603_RS_VS_YS]  (value not drawn)
D4  150060VS73220  [WL-SMCC_0603_RS_VS_YS]  (value not drawn)
R21  Resistance: 620R  Tolerance: 1%  Power Rating: 100mW  [0603 RESISTOR]  (hidden comment: MCMR06X6200FTL)
R22  Resistance: 620R  Tolerance: 1%  Power Rating: 100mW  [0603 RESISTOR]  (hidden comment: MCMR06X6200FTL)
R23  Resistance: 33.2kR  Tolerance: 1%  Power Rating: 62.5mW  [0402 RESISTOR]  (hidden comment: MCWR04X3322FTL)
R24  Resistance: 10.7kR  Tolerance: 1%  Power Rating: 62.5mW  [0402 RESISTOR]  (hidden comment: MCWR04X1072FTL)
R25  Resistance: 33.2kR  Tolerance: 1%  Power Rating: 62.5mW  [0402 RESISTOR]  (hidden comment: MCWR04X3322FTL)
R26  Resistance: 10.7kR  Tolerance: 1%  Power Rating: 62.5mW  [0402 RESISTOR]  (hidden comment: MCWR04X1072FTL)
U9  TPS7A8701RTJT  [QFN50P400X400X80_HS-21N]

### Ports
IN1 (out), IN2 (out), OUT1 (out), OUT2 (out), PG1 (out), PG2 (out)

### Nets
AVDD: C28.2 R21.2 R25.1 U9.11(OUT2) U9.12(OUT2) ; port OUT2
DVDD: C24.2 R22.2 R23.1 U9.14(OUT1) U9.15(OUT1) ; port OUT1
GND: C24.1 C25.1 C26.1 C27.1 C28.1 C29.1 D3.1(K) D4.1(K) R24.1 R26.1 U9.3(GND) U9.8(SS_CTRL2) U9.13(GND) U9.18(SS_CTRL1) U9.21(EP)
IVUSB: C25.2 C27.2 U9.1(IN1) U9.2(IN1) U9.4(IN2) U9.5(IN2) U9.6(EN2) U9.20(EN1) ; port IN1, port IN2
FB1: R23.2 R24.2 U9.16(FB1)
FB2: R25.2 R26.2 U9.10(FB2)
PG1: U9.17(PG1) ; port PG1
PG2: U9.9(PG2) ; port PG2
NetC26_2: C26.2 U9.19(NR/SS1)
NetC29_2: C29.2 U9.7(NR/SS2)
NetD3_2: D3.2(A) R21.1
NetD4_2: D4.2(A) R22.1

### Notes on the sheet
- (near R24) 3.3V SET
- (near R26) 3.3V SET

### Library data of the parts
C24 C25 C27 C28 = CMP-001-00091-2: as C3 on sheet Systolic; Max Operating Temperature: 85°C; Radiation Hardening: No; Voltage: 6.3V; Case Code (Metric): 1608; Case/Package: 0603; Tolerance: 10%; Dielectric: X5R; Mount: Surface Mount; Packaging: Tape and Reel; Height: 0.8mm; Thickness: 0.035inch; Length: 1.6mm; Contact Plating: Tin; Package Quantity: 1; Depth: 0.8mm; Min Operating Temperature: -55°C; Width: 0.031inch; Material: Ceramic; Case Code (Imperial): 0603
C26 C29 = CMP-001-00090-2: Cap Ceramic 10nF 16V X7R 5% SMD 0402 125°C; Case Code (Imperial): 0402; Case Code (Metric): 1005; Packaging: Tape and Reel; Min Operating Temperature: -55°C; Voltage Rating (DC): 16V; Case/Package: 0402; Dielectric: X7R; REACH SVHC: Unknown; Tolerance: 5%; Max Operating Temperature: 125°C
D3 D4 = 150060VS73220: as D2 on sheet USB Input; ComponentLink1URL: http://www.we-online.de; ComponentLink2Description: Datasheet; ComponentLink2URL: https://katalog.we-online.com/led/datasheet/150060VS73220.pdf; Part Number: 150060VS73220; Published Date: July 2019; Publisher: Wurth Elektronik; Size: 0603; Viewing Angle: 120deg; Packaging: Tape and Reel; Emitting Color: Bright Green; Mounting Technology: SMT; Forward Voltage: 2V; Operating Temperature: -40 to +85degC
R21 R22 = CMP-009-00202-2: as R9 on sheet USB Input; Case/Package: 0603; Case Code (Metric): 1608; Packaging: Cut Tape; REACH SVHC: No SVHC; Case Code (Imperial): 0603; Composition: Ceramic; Voltage Rating (DC): 75V
R23 R25 = CMP-009-00187-1: MULTICOMP - MCMR04X24R0FTL - RES, CERAMIC 33.2kR, 1%, 0.063W, 0402; Voltage Rating (DC): 50V; Temperature Coefficient: 100ppm/°C; Voltage Rating: 50V; Case Code (Imperial): 0402; Composition: Ceramic; Case Code (Metric): 1005; Packaging: Cut Tape; REACH SVHC: No SVHC; Case/Package: 0402
R24 R26 = CMP-009-00185-1: as R2 on sheet Systolic; Case Code (Metric): 1005; Composition: Ceramic; REACH SVHC: No SVHC; Case Code (Imperial): 0402; Packaging: Cut Tape; Voltage Rating: 50V; Case/Package: 0402
U9 = CMP-019-00051-1: IC REG LIN POS ADJ 500MA 20QFN; Min Input Voltage: 1.4V; Dropout Voltage: 100mV; Quiescent Current: 2.1mA; Voltage - Output 2: 5.2V; Number of Outputs: 2; Max Input Voltage: 6.5V; Packaging: Cut Tape; Lead Free: Lead Free; Current - Output 2: 500mA; REACH SVHC: No SVHC; Voltage - Output 1: 5.2V; Number of Pins: 20; Current - Output 1: 500mA; Min Operating Temperature: -40°C; Max Operating Temperature: 125°C

## Sheet ECG FILTER.SchDoc
size A
Used 4 times, as channels FL1, FL2, FL3, FL1. Parts and nets are listed once, with the designators drawn on the sheet.
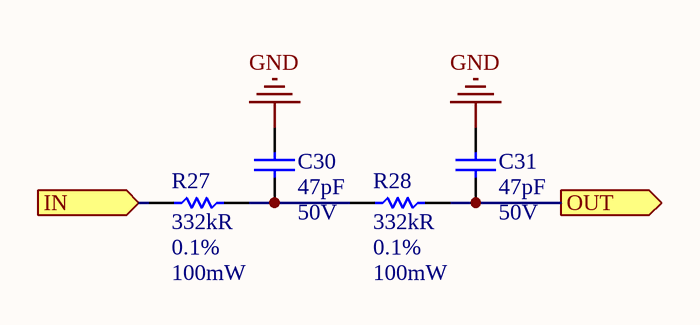
[diagram p5: ECG FILTER.SchDoc]

### Parts
C30  Capacitance: 47pF  Voltage Rating: 50V  [0402 CAPACITOR]  (hidden comment: MCMT15N470F500CT)
C31  Capacitance: 47pF  Voltage Rating: 50V  [0402 CAPACITOR]  (hidden comment: MCMT15N470F500CT)
R27  Resistance: 332kR  Tolerance: 0.1%  Power Rating: 100mW  [MCT06030E3323BP100]  (hidden comment: MCT06030E3323BP100)
R28  Resistance: 332kR  Tolerance: 0.1%  Power Rating: 100mW  [MCT06030E3323BP100]  (hidden comment: MCT06030E3323BP100)

### Ports
IN (in), OUT (out)

### Nets
GND: C30.2 C31.2
IN: R27.1 ; port IN
OUT: C31.1 R28.2 ; port OUT
NetC30_1: C30.1 R27.2 R28.1

### Channels
FL1: designators end in _FL1#1; ports IN=LA OUT=IN1
FL2: designators end in _FL2; ports IN=RA OUT=IN2
FL3: designators end in _FL3; ports IN=LL OUT=IN3
FL1: designators end in _FL1#2; ports IN=RL OUT=IN4

### Library data of the parts
C30 C31 = CMP-001-00088-3: Cap Ceramic 47pF 50V C0G 1% SMD 0402 125°C; Dielectric: C0G; Case Code (Metric): 1005; Max Operating Temperature: 125°C; Case/Package: 0402; Tolerance: 1%; Voltage Rating (DC): 50V; REACH SVHC: No SVHC; Packaging: Cut Tape; Case Code (Imperial): 0402; Min Operating Temperature: -55°C
R27 R28 = CMP-009-00191-2: Surface Mount Thin Film Resistor, Mct Series, 332 Kohm, 100 Mw, - 0.1%, 75 V Rohs Compliant: Yes; Voltage Rating: 75V; Composition: Thin Film; Voltage Rating (DC): 75V; REACH SVHC: Unknown; Lead Free: Lead Free; Packaging: Cut Tape; Case Code (Metric): 1608; Case Code (Imperial): 0603; Mount: Surface Mount; Case/Package: 0603

## Nets that join several sheets
AVDD: Systolic (C1.2 C2.2 R1.1), ECG FRONT (7 pins), LDOSUPPLY (5 pins)
DVDD: Systolic (14 pins), LDOSUPPLY (5 pins)
GND: Systolic (24 pins), USB Isolation (10 pins), ECG FRONT (8 pins), LDOSUPPLY (15 pins), FL1 (C30_FL1#1.2 C31_FL1#1.2), FL2 (C30_FL2.2 C31_FL2.2), FL3 (C30_FL3.2 C31_FL3.2), FL1 (C30_FL1#2.2 C31_FL1#2.2)
GND1: USB Input (15 pins), USB Isolation (6 pins)
IVUSB: USB Isolation (7 pins), LDOSUPPLY (8 pins)
VUSB1: USB Input (C12.2 R9.2 U2.6 U2.8), USB Isolation (C14.2 C15.2 L1.1 U6.1)
ALARMB: Systolic (U1.25), ECG FRONT (R18.1 U8.15)
D_N: USB Input (J5.2 U4.3), USB Isolation (R12.1)
D_P: USB Input (J5.3 U4.2), USB Isolation (R10.1)
DRDYB: Systolic (U1.28), ECG FRONT (R15.1 R16.2)
IN1: ECG FRONT (U8.1), FL1 (C31_FL1#1.1 R28_FL1#1.2)
IN2: ECG FRONT (U8.2), FL2 (C31_FL2.1 R28_FL2.2)
IN3: ECG FRONT (U8.3), FL3 (C31_FL3.1 R28_FL3.2)
IN4: ECG FRONT (U8.4), FL1 (C31_FL1#2.1 R28_FL1#2.2)
LA: Systolic (J1.1), FL1 (R27_FL1#1.1)
LL: Systolic (J1.2), FL3 (R27_FL3.1)
NetR1_2: Systolic (R1.2), ECG FRONT (U8.13)
RA: Systolic (J1.3), FL2 (R27_FL2.1)
RL: Systolic (J2.2), FL1 (R27_FL1#2.1)
SPI1_CS: Systolic (R6.1), ECG FRONT (U8.16)
SPI1_MISO: Systolic (U1.22), ECG FRONT (R17.2)
SPI1_MOSI: Systolic (R8.1), ECG FRONT (U8.18)
SPI1_SCK: Systolic (R7.1), ECG FRONT (U8.17)
USBD_N: Systolic (U1.44), USB Isolation (R13.2)
USBD_P: Systolic (U1.45), USB Isolation (R11.2)
XTAL_N: Systolic (C1.1 Y1.1), ECG FRONT (U8.23)
XTAL_P: Systolic (C2.1 Y1.2), ECG FRONT (U8.24)